# Altium schematic sheet Driver PT5619_Table SchDoc.SchDoc
size A3
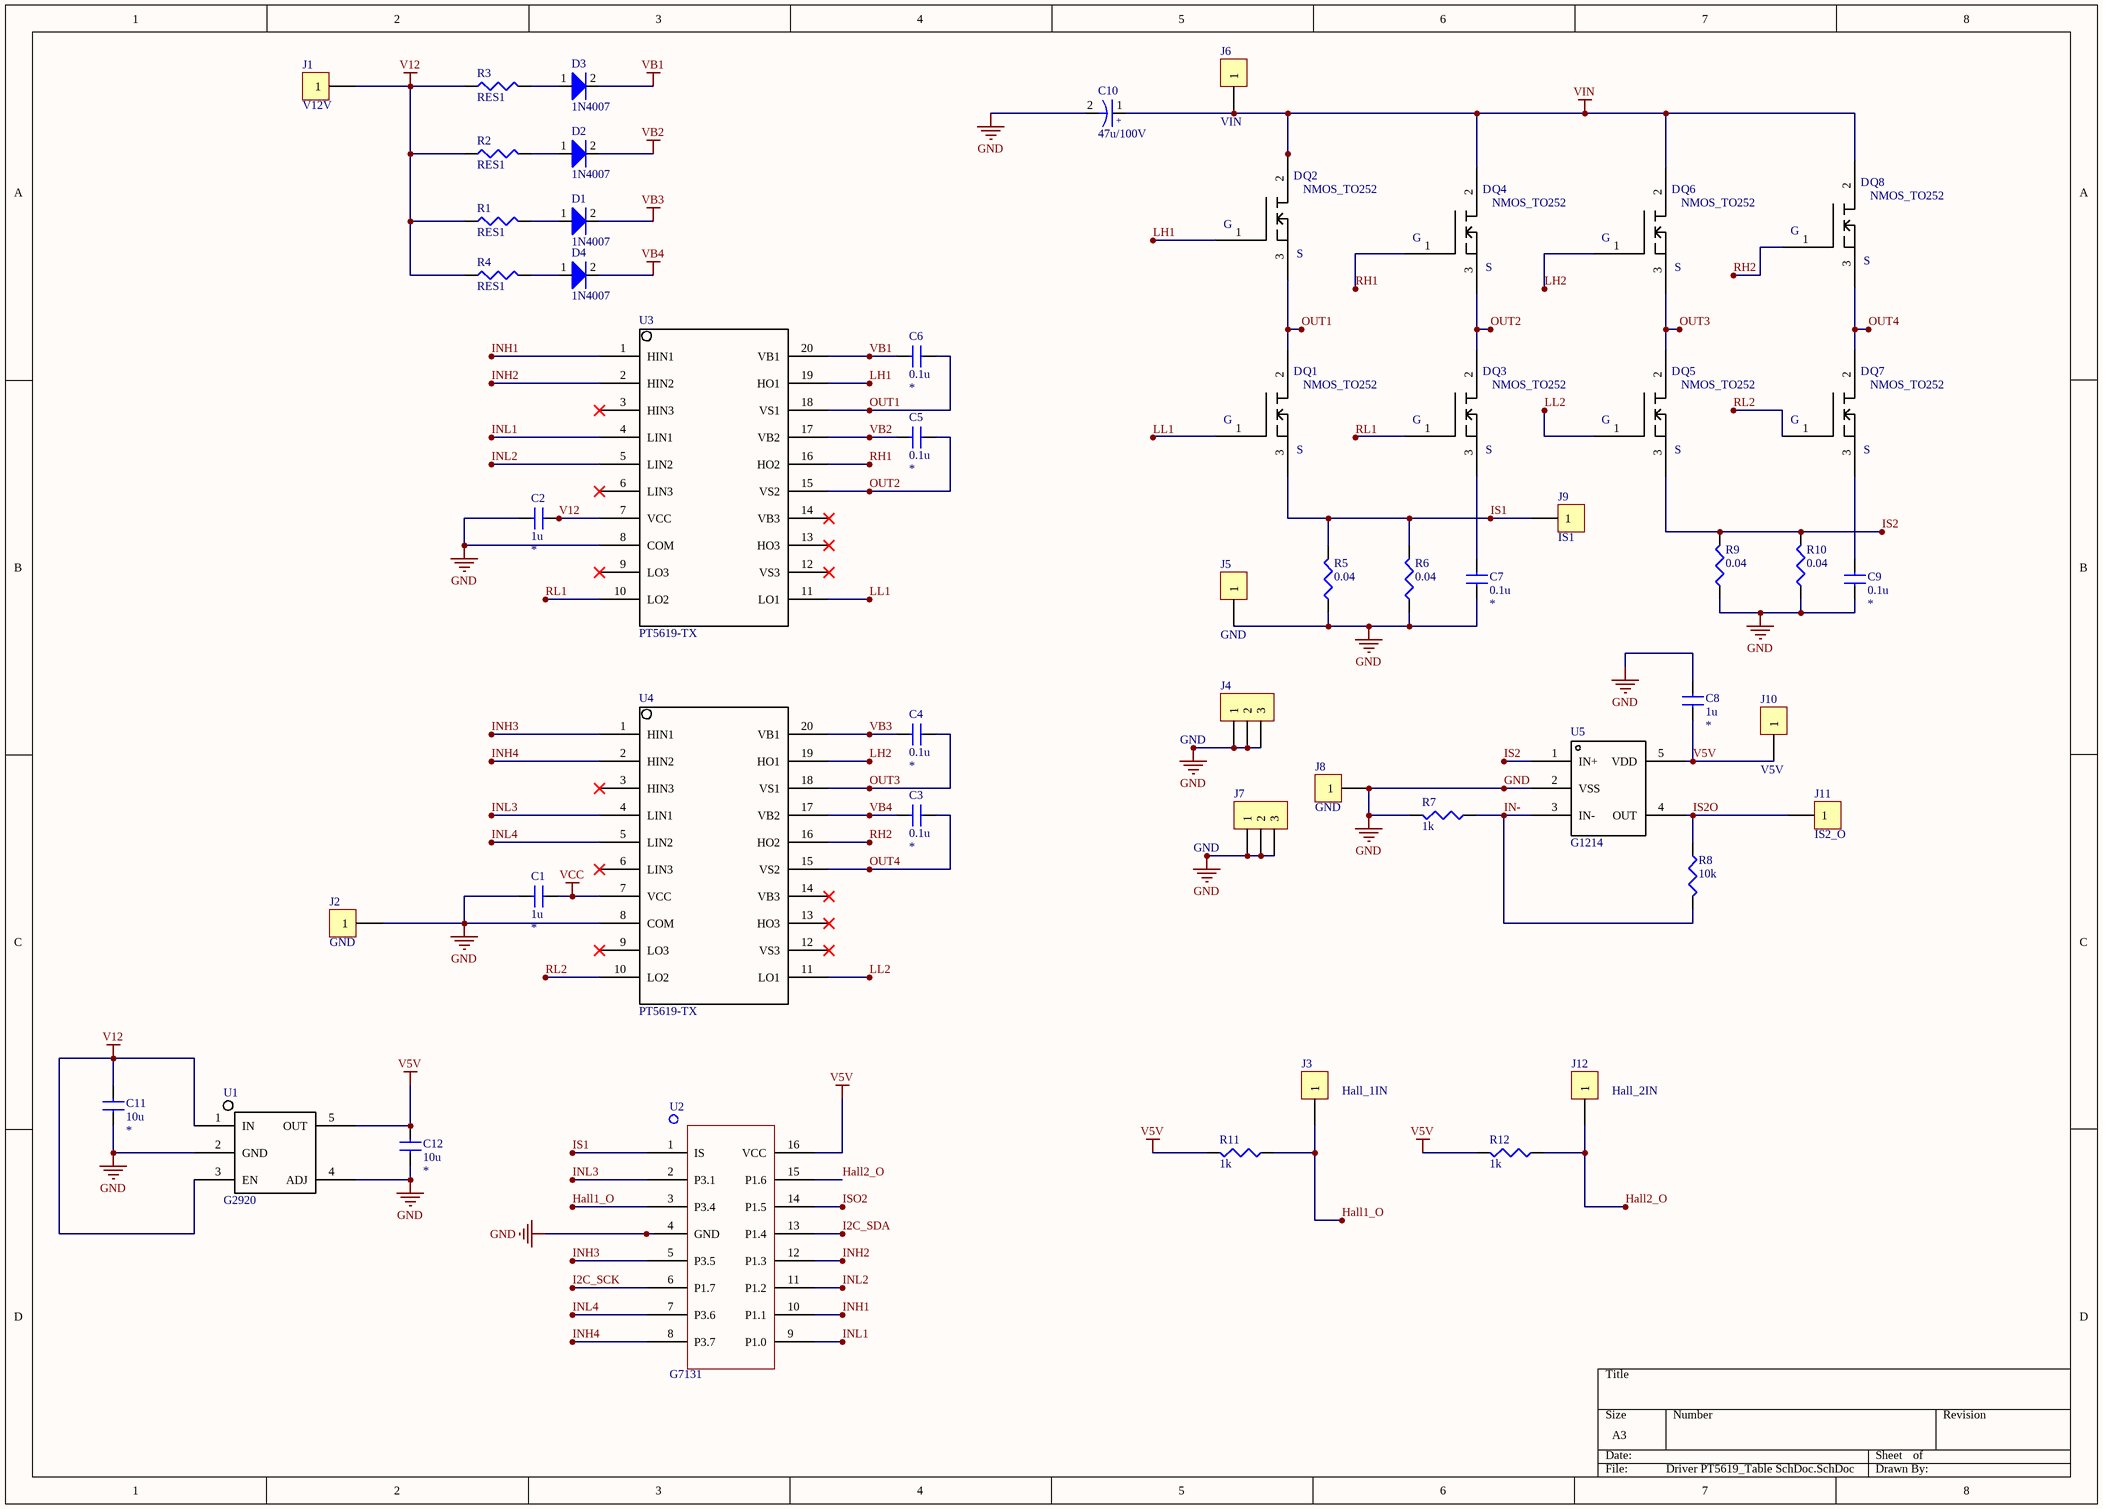
[diagram p0: Driver PT5619_Table SchDoc.SchDoc]

## Parts
C1  1u  [0805_C]
C2  1u  [0805_C]
C3  0.1u  [0805_C]
C4  0.1u  [0805_C]
C5  0.1u  [0805_C]
C6  0.1u  [0805_C]
C7  0.1u  [0805_C]
C8  1u  [0805_R]
C9  0.1u  [0805_C]
C10  47u/100V
C11  10u
C12  10u
D1  1N4007  [DIODE-1206]
D2  1N4007  [DIODE-1206]
D3  1N4007  [DIODE-1206]
D4  1N4007  [DIODE-1206]
J1  V12V  [CON1]
J2  GND  [CON1]
J3  Hall_1IN
J4  GND  [CON3]
J5  GND  [CON1]
J6  VIN  [CON1]
J7  GND  [CON3]
J8  GND  [CON1]
J9  IS1  [CON1s]
J10  V5V  [CON1]
J11  IS2_O  [CON1s]
J12  Hall_2IN
Q1  NMOS_TO252  [TO220]
Q2  NMOS_TO252  [TO220]
Q3  NMOS_TO252  [TO220]
Q4  NMOS_TO252  [TO220]
Q5  NMOS_TO252  [TO220 - duplicate]
Q6  NMOS_TO252  [TO220]
Q7  NMOS_TO252  [TO220]
Q8  NMOS_TO252  [TO220]
R1  RES1  [0805_R]
R2  RES1  [0805_R]
R3  RES1  [0805_R]
R4  RES1  [0805_R]
R5  0.04  [2512]
R6  0.04  [2512]
R7  1k  [0805_R]
R8  10k  [0805_R]
R9  0.04  [2512]
R10  0.04  [2512]
R11  1k
R12  1k
U1  G2920
U2  G7131
U3  PT5619-TX  [TSSOP20]
U4  PT5619-TX  [TSSOP20]
U5  G1214  [SOT-23-5-G1211]

## Nets
GND: C1.2 C2.1 C7.2 C8.2 C9.2 C10.2 C11.2 C12.2 J2.1 J4.1 J4.2 J4.3 J5.1 J7.1 J7.2 J7.3 J8.1 R5.1 R6.1 R7.2 R9.1 R10.1 U1.2(GND) U1.4(ADJ) U2.4(GND) U3.8(COM) U4.8(COM) U5.2(VSS)
V5V: C8.1 C12.1 J10.1 R11.2 R12.2 U1.5(OUT) U2.16(VCC) U5.5(VDD)
V12: C2.2 C11.1 J1.1 R1.1 R2.1 R3.1 R4.1 U1.1(IN) U1.3(EN) U3.7(VCC)
VB1: C6.1 D3.2(n2) U3.20(VB1)
VB2: C5.1 D2.2(n2) U3.17(VB2)
VB3: C4.1 D1.2(n2) U4.20(VB1)
VB4: C3.1 D4.2(n2) U4.17(VB2)
VCC: C1.1 U4.7(VCC)
VIN: C10.1 J6.1 Q2.2(D) Q4.2(D) Q6.2(D) Q8.2(D)
Hall1_O: J3.1 R11.1 U2.3(P3.4)
Hall2_O: J12.1 R12.1 U2.15(P1.6)
I2C_SCK: U2.6(P1.7)
I2C_SDA: U2.13(P1.4)
IN-: R7.1 R8.2 U5.3(IN-)
INH1: U2.10(P1.1) U3.1(HIN1)
INH2: U2.12(P1.3) U3.2(HIN2)
INH3: U2.5(P3.5) U4.1(HIN1)
INH4: U2.8(P3.7) U4.2(HIN2)
INL1: U2.9(P1.0) U3.4(LIN1)
INL2: U2.11(P1.2) U3.5(LIN2)
INL3: U2.2(P3.1) U4.4(LIN1)
INL4: U2.7(P3.6) U4.5(LIN2)
IS1: J9.1 Q1.3(S) R5.2 R6.2 U2.1(IS)
IS2: Q5.3(S) R9.2 R10.2 U5.1(IN+)
IS2O: J11.1 R8.1 U5.4(OUT)
ISO2: U2.14(P1.5)
LH1: Q2.1(G) U3.19(HO1)
LH2: Q6.1(G) U4.19(HO1)
LL1: Q1.1(G) U3.11(LO1)
LL2: Q5.1(G) U4.11(LO1)
OUT1: C6.2 Q1.2(D) Q2.3(S) U3.18(VS1)
OUT2: C5.2 Q3.2(D) Q4.3(S) U3.15(VS2)
OUT3: C4.2 Q5.2(D) Q6.3(S) U4.18(VS1)
OUT4: C3.2 Q7.2(D) Q8.3(S) U4.15(VS2)
RH1: Q4.1(G) U3.16(HO2)
RH2: Q8.1(G) U4.16(HO2)
RL1: Q3.1(G) U3.10(LO2)
RL2: Q7.1(G) U4.10(LO2)
NetC7_1: C7.1 Q3.3(S)
NetC9_1: C9.1 Q7.3(S)
NetD1_1: D1.1(n1) R1.2
NetD2_1: D2.1(n1) R2.2
NetD3_1: D3.1(n1) R3.2
NetD4_1: D4.1(n1) R4.2

Not connected (* = marked no-connect by the designer): U3 3(HIN3)* 6(LIN3)* 9(LO3)* 12(VS3)* 13(HO3)* 14(VB3)*; U4 3(HIN3)* 6(LIN3)* 9(LO3)* 12(VS3)* 13(HO3)* 14(VB3)*

## Notes on the sheet
- (in symbol CAPACITOR POL) +

## Library data of the parts
C1-C9 C11 C12 = CAP: Capacitor; IC: *
C10 = CAPACITOR POL: Capacitor
D1-D4 = DIODE_D: Junction Diode
J1-J3 J5 J6 J8-J12 = CON1: Connector
J4 J7 = CON3: Connector
R5-R12 = RES1